# EAGLE design bluz_jlink_shield_v1_revC (EAGLE 7.3.0)
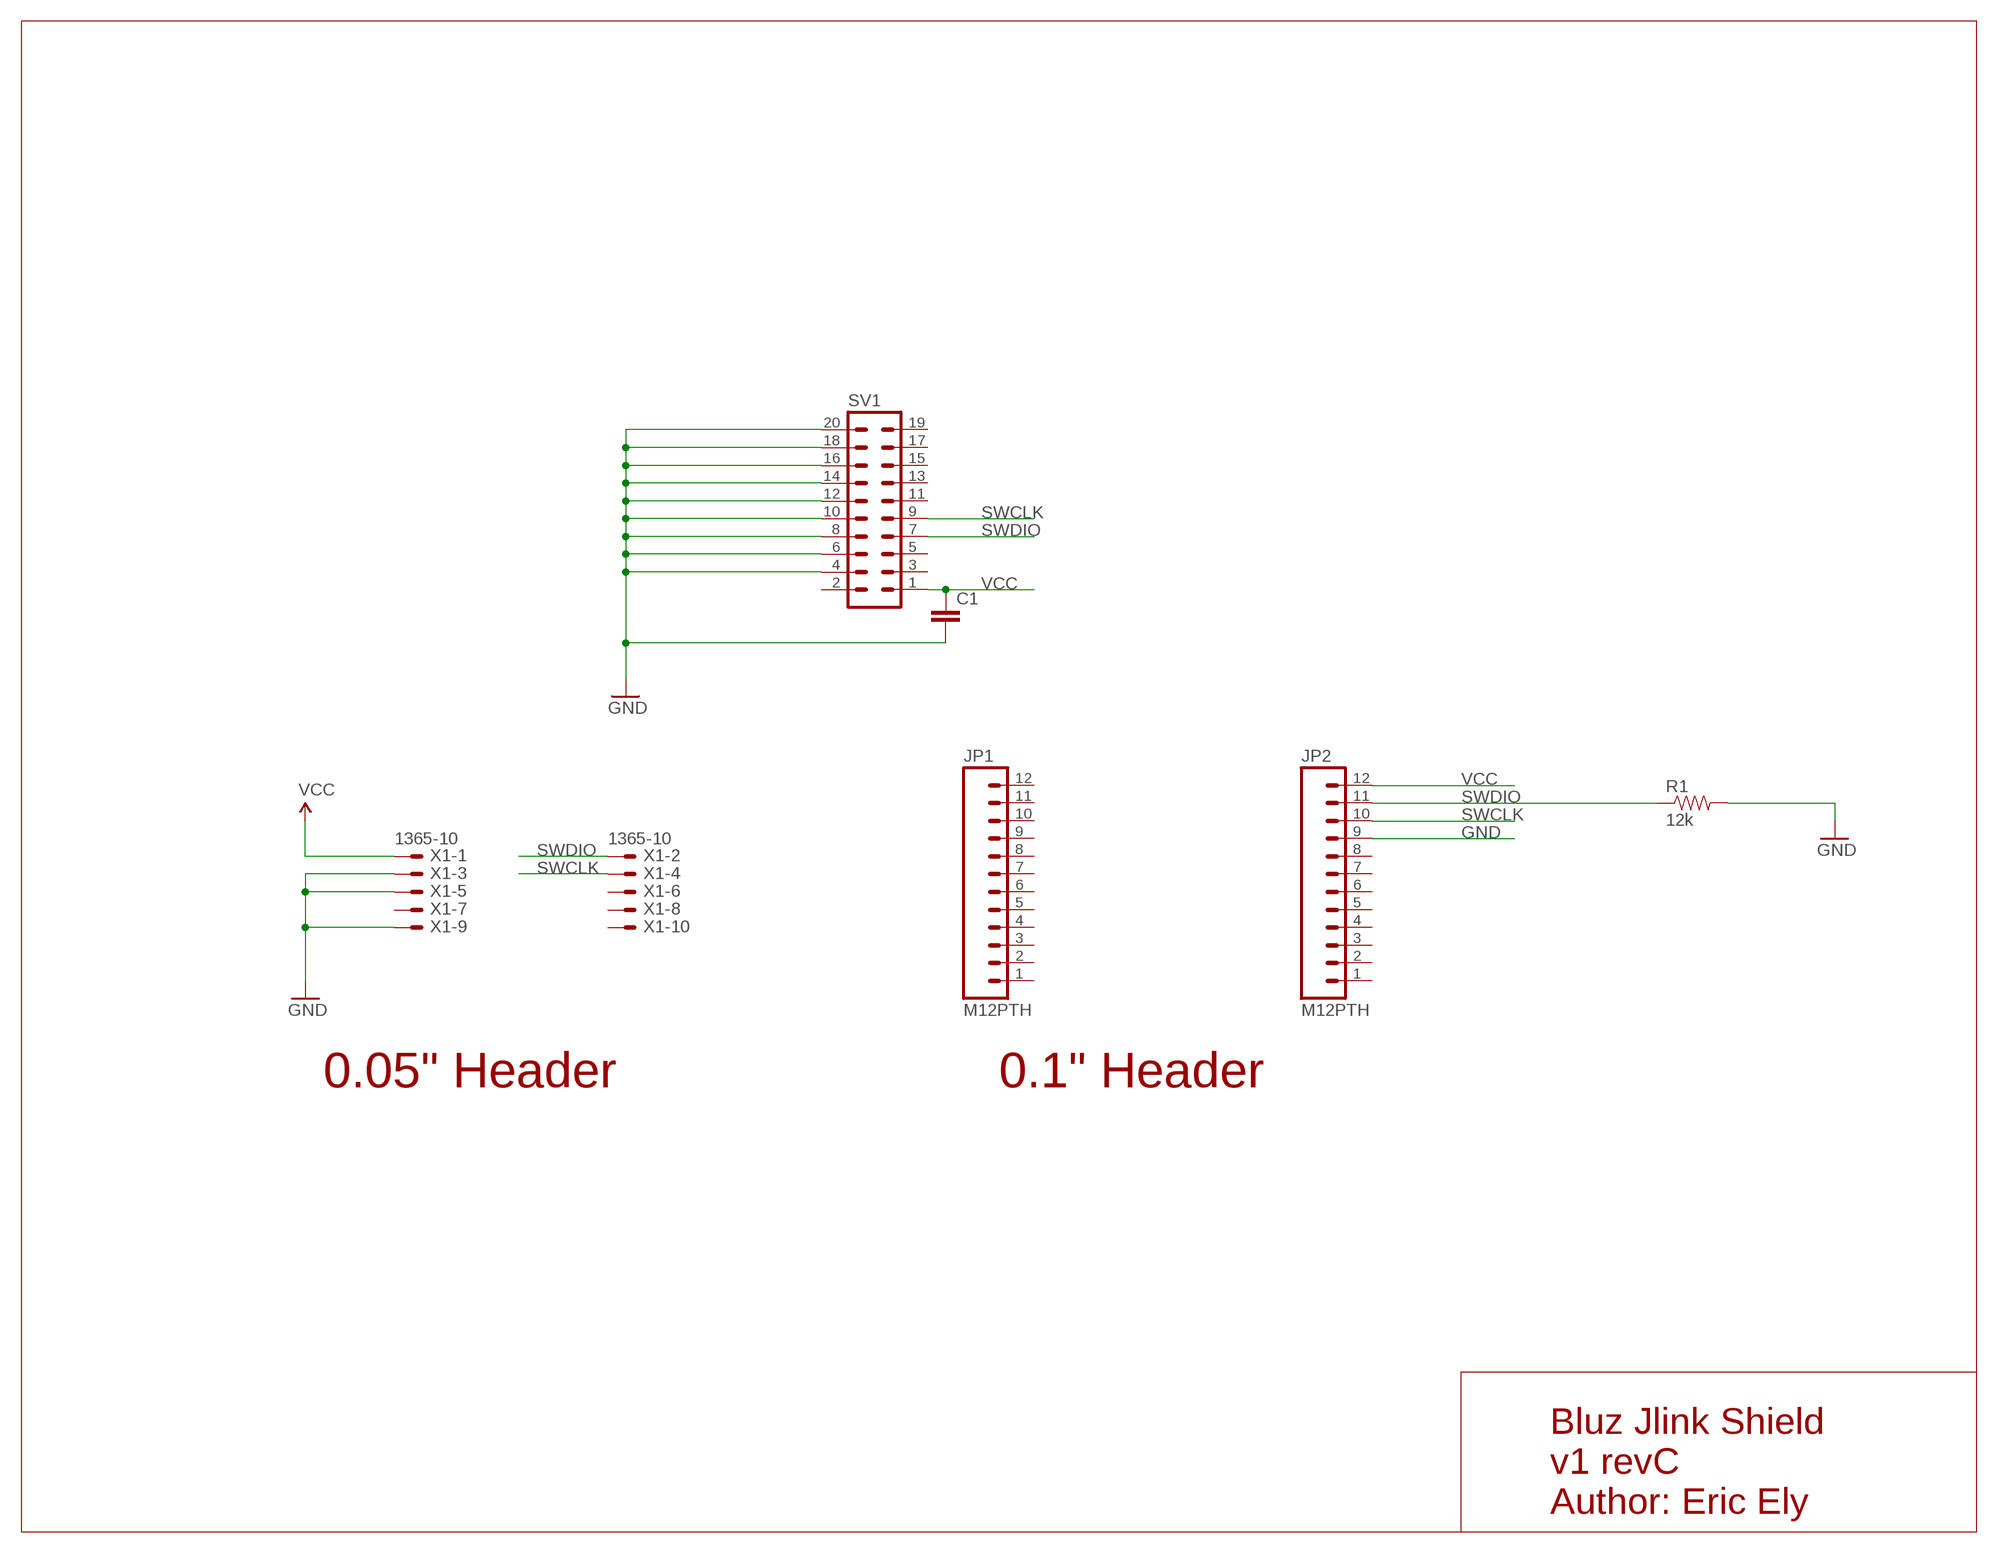
[diagram p0: schematic, sheet 1]

## Parts
C1  CAP0603-CAP  [0603-CAP]
JP1  M12PTH  [1X12]
JP2  M12PTH  [1X12]
R1  12k  RESISTOR0603  [0603-RES]
SV1  ML20  [ML20]
X1  1365-10  [1365-10]

## Nets
GND: C1.2 JP2.9 R1.2 SV1.4 SV1.6 SV1.8 SV1.10 SV1.12 SV1.14 SV1.16 SV1.18 SV1.20 X1.3 X1.5 X1.9
SWCLK: JP2.10 SV1.9 X1.4
SWDIO: JP2.11 R1.1 SV1.7 X1.2
VCC: C1.1 JP2.12 SV1.1 X1.1
Unconnected: JP1.1 JP1.2 JP1.3 JP1.4 JP1.5 JP1.6 JP1.7 JP1.8 JP1.9 JP1.10 JP1.11 JP1.12 JP2.1 JP2.2 JP2.3 JP2.4 JP2.5 JP2.6 JP2.7 JP2.8 SV1.2 SV1.3 SV1.5 SV1.11 SV1.13 SV1.15 SV1.17 SV1.19 X1.6 X1.7 X1.8 X1.10

## Notes on the sheet
- 0.05" Header | 0.1" Header
- Bluz Jlink Shield
  v1 revC
  Author: Eric Ely

## Library data of the parts
C1 = SparkFun-Capacitors:CAP: Capacitor Standard 0603 ceramic capacitor, and 0.1" leaded capacitor.
JP1 JP2 = SparkFun-Connectors:M12: Header 12 Standard 12-pin 0.1" header. Use with straight break away headers (SKU : PRT-00116), right angle break away headers (PRT-00553), swiss pins (PRT-00743), machine pins (PRT-00117), and female headers (PRT-00115).
R1 = SparkFun-Resistors:RESISTOR: Resistor Basic schematic elements and footprints for 0603, 1206, and PTH resistors.
SV1 = Spark2:ML20: HARTING; OC_FARNELL: unknown; OC_NEWARK: unknown
X1 = con-leotronics:1365-10: DUAL ROW STRAIGHT HEADER 1364 SERIES. 1.27mm x 1.27mm. Without Fixing Post. SMT Source: http://www.leotronics.co.uk/Conexcon/Data%20Sheets/sec.%20A/1364ing.pdf; OC_FARNELL: unknown; OC_NEWARK: unknown

## Board
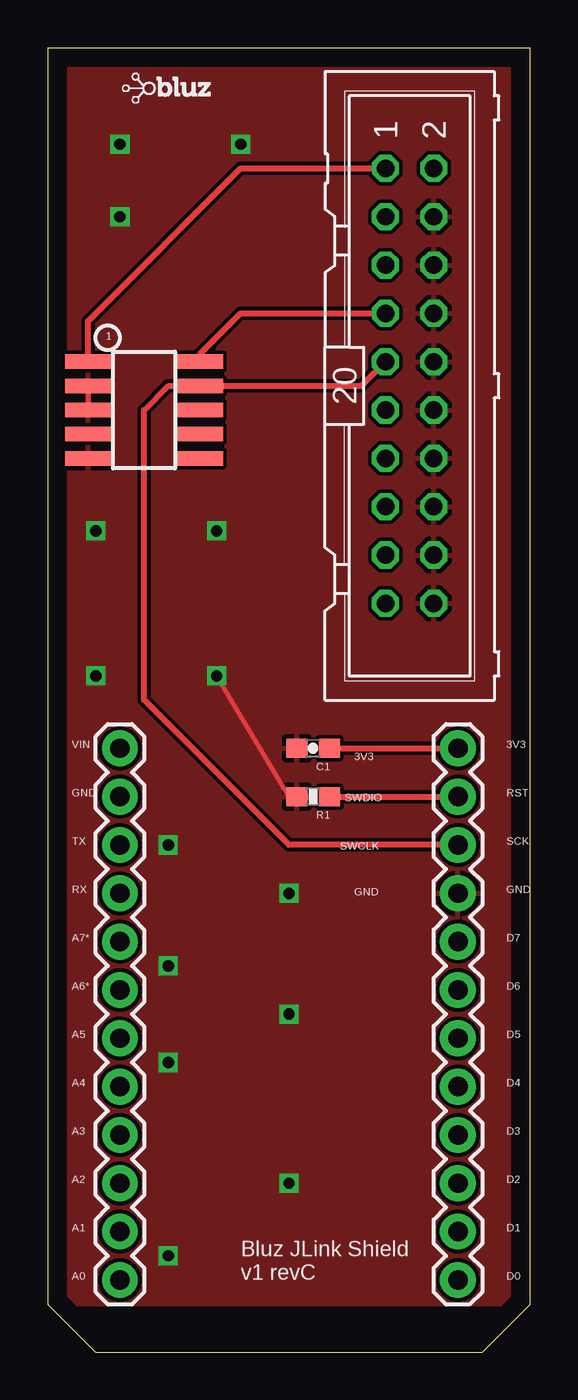
[diagram p1: board, top side]
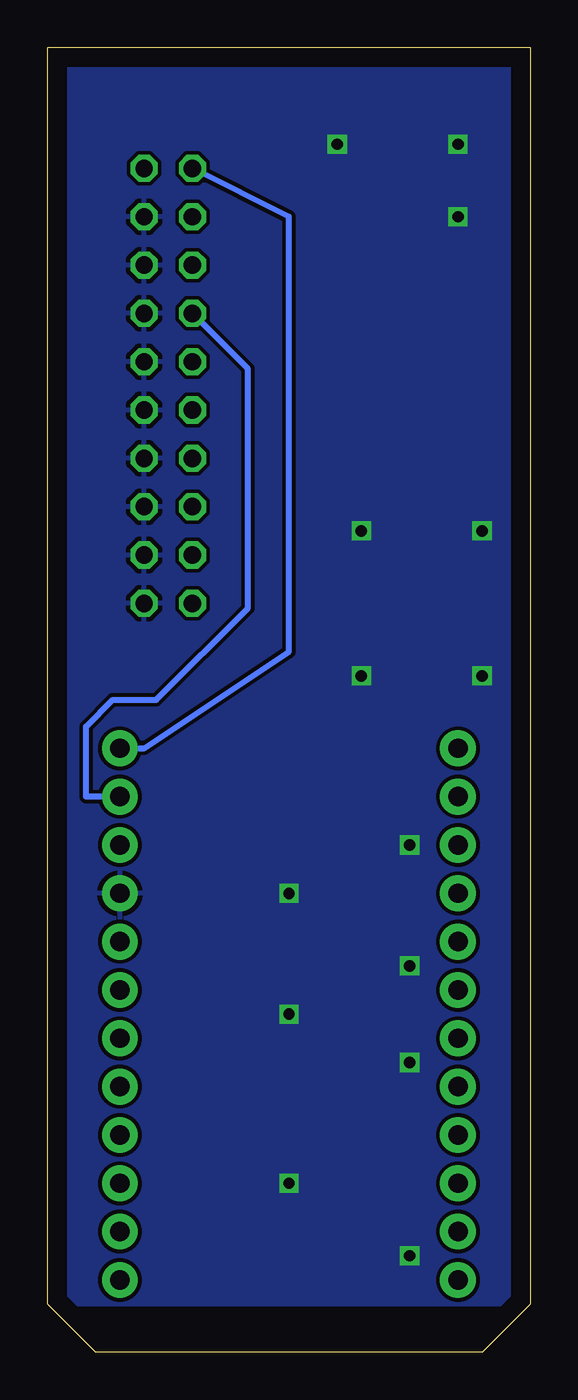
[diagram p2: board, bottom side, seen from below]

Size 25.4 x 68.58 mm. Coordinates in mm from the lower left corner, seen from the top.
Outline: 2.54,0 22.86,0 25.4,2.54 25.4,68.58 0,68.58 0,2.54 2.54,0
Copper layers (1*16): Top 0.035mm / dielectric 1.5mm / Bottom 0.035mm
Design rules "default *": minimum track width 10mil, minimum drill 24mil, track to track 8mil, track to pad 8mil, pad to pad 8mil, via to via 8mil, smd to smd 8mil, copper to edge 40mil, drill to drill 8mil, minimum pad ring 10mil, minimum via ring 8mil, stop-mask expansion 4mil, vias tented up to drill 25mil, thermal gap 10mil

### Footprints (pad centres in the part's own frame; a part is rotated, then mirrored left to right if it is on the bottom)
0603-CAP = smd 1.1 x 1: 1 -0.85,0; 2 0.85,0
1X12 = drill 1.016 pad 1.88: 1 0,0; 2 2.54,0; 3 5.08,0; 4 7.62,0; 5 10.16,0; 6 12.7,0; 7 15.24,0; 8 17.78,0; 9 20.32,0; 10 22.86,0; 11 25.4,0; 12 27.94,0
0603-RES = smd 1.1 x 1: 1 -0.85,0; 2 0.85,0
ML20 = drill 0.914 octagon: 1 -11.43,-1.27; 2 -11.43,1.27; 3 -8.89,-1.27; 4 -8.89,1.27; 5 -6.35,-1.27; 6 -6.35,1.27; 7 -3.81,-1.27; 8 -3.81,1.27; 9 -1.27,-1.27; 10 -1.27,1.27; 11 1.27,-1.27; 12 1.27,1.27; 13 3.81,-1.27; 14 3.81,1.27; 15 6.35,-1.27; 16 6.35,1.27; 17 8.89,-1.27; 18 8.89,1.27; 19 11.43,-1.27; 20 11.43,1.27
1365-10 = smd 0.76 x 2.4: 1 -2.54,-2.95; 2 -2.54,2.95; 3 -1.27,-2.95; 4 -1.27,2.95; 5 0,-2.95; 6 0,2.95; 7 1.27,-2.95; 8 1.27,2.95; 9 2.54,-2.95; 10 2.54,2.95

### Placement (x,y rotation side)
C1  13.97,31.75 180 top
JP1  3.81,3.81 90 top
JP2  21.59,3.81 90 top
R1  13.97,29.21 180 top
SV1  19.05,50.8 270 top
U$1  [BLUZE_LOGO_LOW_RES]  3.94,65.66 0 top
X1  5.08,49.53 270 top

### Tracks (layer width: path | path; a pad name or v marks a point on that pad's centre or on a via)
GND  (via drill 0.6)
  Top 0.254: X1.3 X1.5 | R1.2 12.7,29.21 v8.89,35.56
  other vias: 6.35,26.67 12.7,24.13 6.35,20.32 12.7,17.78 6.35,15.24 6.35,5.08 12.7,8.89 3.81,63.5 10.16,63.5 3.81,59.69 8.89,43.18 2.54,43.18 2.54,35.56
  pour Bottom: 0,2.54 25.4,2.54 25.4,68.58 0,68.58
  pour Top: 0,68.58 25.4,68.58 25.4,2.54 0,2.54
SWCLK
  Top 0.305: JP2.10 12.7,26.67 5.08,34.29 5.08,49.53 6.35,50.8 X1.4 16.51,50.8 SV1.9
SWDIO  (via drill 0.6)
  Top 0.305: X1.2 8.03,52.48 10.16,54.61 SV1.7 | R1.1 JP2.11
  Bottom 0.305: JP2.11 23.37,29.21 23.37,32.89 21.97,34.29 19.68,34.29 14.86,39.12 14.86,51.69 SV1.7
  other vias: 21.59,29.21
VCC
  Top 0.305: X1.1 2.13,54.2 10.16,62.23 SV1.1 | C1.1 JP2.12
  Bottom 0.305: JP2.12 20.32,31.75 12.7,36.83 12.7,59.69 SV1.1

### Text on the board
tPlace: 1 | VIN | 3V3 | 3V3 | GND | SWDIO | RST | TX | SCK | SWCLK | RX | GND | GND | A7* | D7 | A6* | D6 | A5 | D5 | A4 | D4 | A3 | D3 | A2 | D2 | A1 | D1 | A0 | Bluz JLink Shield / v1 revC | D0